# Altium schematic sheet FPGA_ADC_N.SchDoc
size 393 x 281 mm; PageSetup: Record=PageOptions|CenterHorizontal=True|CenterVertical=True|PrintScale=0.94|XCorrection=0.00|YCorrection=0.00|PrintKind=0|BorderSize=5000000|LeftOffset=0|BottomOffset=0|Orientation=2|PaperLength=1000|PaperWidth=1000|Scale=100|PaperSource=15|PrintQuality=600|MediaType=1|DitherType=10|PrintScaleMode=1|PaperKind=A4; Adr1: August Barks gata 6B; Adr2: SE-421 32 Västra Frölunda; Adr3: Sweden; Webpage: www.omnisys.se
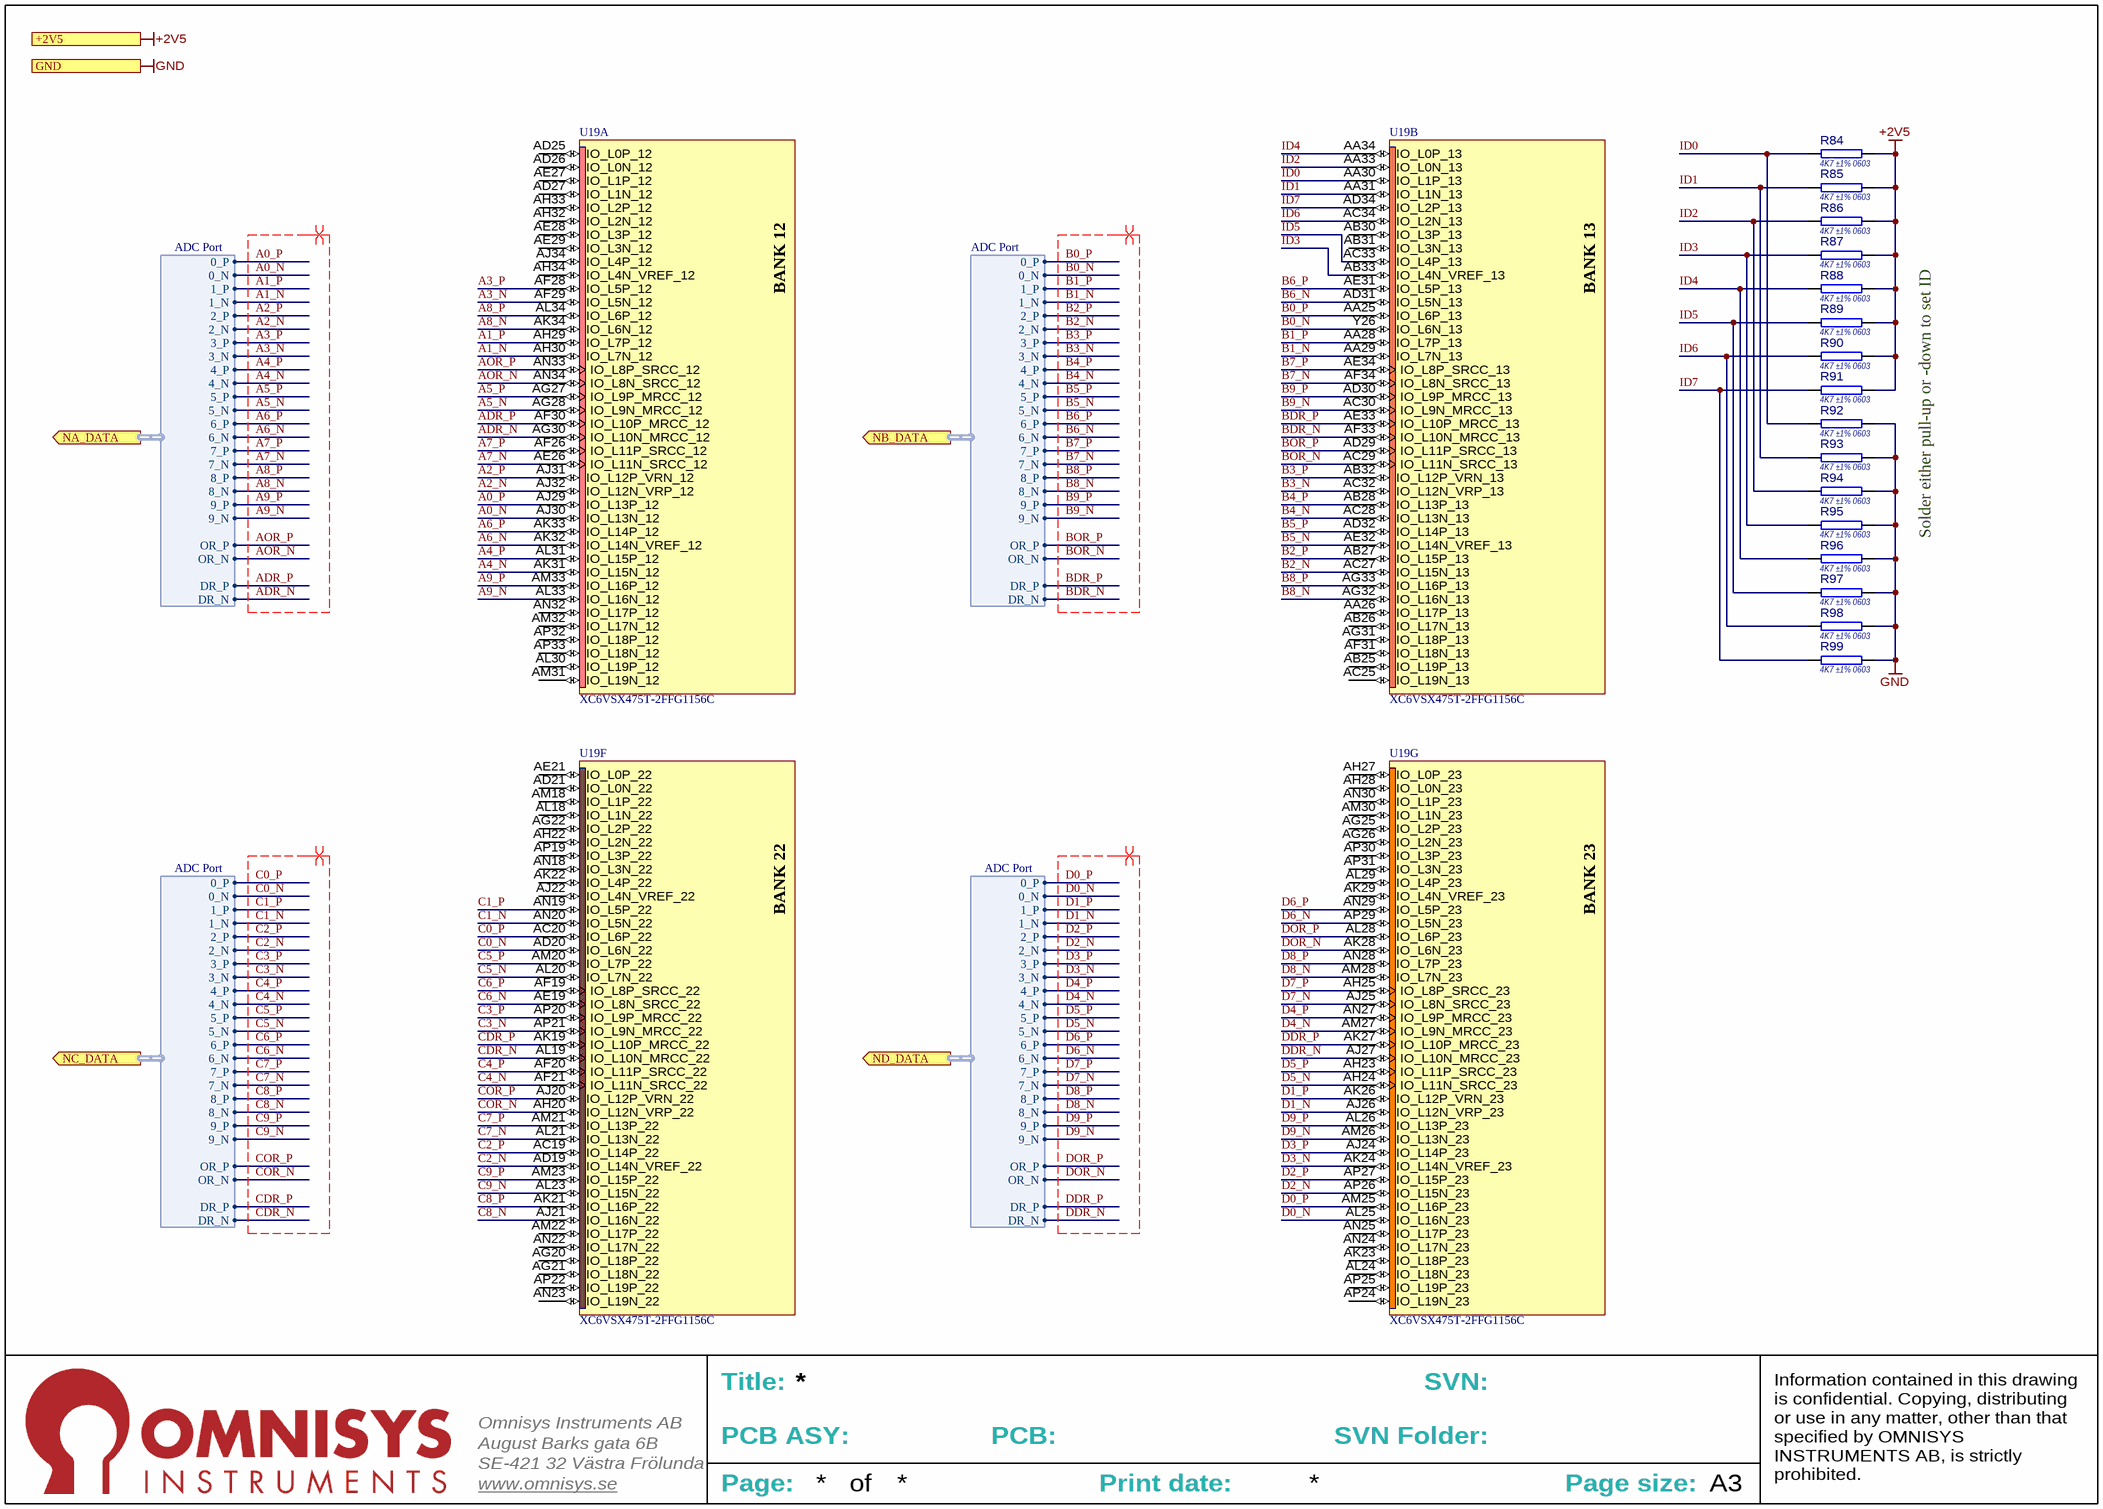
[diagram p0: FPGA_ADC_N.SchDoc]

## Parts
R84  4K7 ±1% 0603  [RESC1608N]
R85  4K7 ±1% 0603  [RESC1608N]
R86  4K7 ±1% 0603  [RESC1608N]
R87  4K7 ±1% 0603  [RESC1608N]
R88  4K7 ±1% 0603  [RESC1608N]
R89  4K7 ±1% 0603  [RESC1608N]
R90  4K7 ±1% 0603  [RESC1608N]
R91  4K7 ±1% 0603  [RESC1608N]
R92  4K7 ±1% 0603  [RESC1608N]
R93  4K7 ±1% 0603  [RESC1608N]
R94  4K7 ±1% 0603  [RESC1608N]
R95  4K7 ±1% 0603  [RESC1608N]
R96  4K7 ±1% 0603  [RESC1608N]
R97  4K7 ±1% 0603  [RESC1608N]
R98  4K7 ±1% 0603  [RESC1608N]
R99  4K7 ±1% 0603  [RESC1608N]
U19  XC6VSX475T-2FFG1156C  [FFG1156]  (parts A,B,F,G of 20)

## Ports
+2V5, GND, NA_DATA (out, harness ADC Port), NB_DATA (out, harness ADC Port), NC_DATA (out, harness ADC Port), ND_DATA (out, harness ADC Port)

## Harnesses
ADC Port: 0_P, 1_P, 2_P, 3_P, 4_P, 5_P, 6_P, 7_P, 8_P, 9_P, 0_N, 1_N, 2_N, 3_N, 4_N, 5_N, 6_N, 7_N, 8_N, 9_N, OR_P, OR_N, DR_P, DR_N

## Nets
+2V5: R84.1 R85.1 R86.1 R87.1 R88.1 R89.1 R90.1 R91.1 ; port +2V5
GND: R92.1 R93.1 R94.1 R95.1 R96.1 R97.1 R98.1 R99.1 ; port GND
A0_N: U19.AJ30(IO_L13N_12) ; port NA_DATA.0_N
A0_P: U19.AJ29(IO_L13P_12) ; port NA_DATA.0_P
A1_N: U19.AH30(IO_L7N_12) ; port NA_DATA.1_N
A1_P: U19.AH29(IO_L7P_12) ; port NA_DATA.1_P
A2_N: U19.AJ32(IO_L12N_VRP_12) ; port NA_DATA.2_N
A2_P: U19.AJ31(IO_L12P_VRN_12) ; port NA_DATA.2_P
A3_N: U19.AF29(IO_L5N_12) ; port NA_DATA.3_N
A3_P: U19.AF28(IO_L5P_12) ; port NA_DATA.3_P
A4_N: U19.AK31(IO_L15N_12) ; port NA_DATA.4_N
A4_P: U19.AL31(IO_L15P_12) ; port NA_DATA.4_P
A5_N: U19.AG28(IO_L9N_MRCC_12) ; port NA_DATA.5_N
A5_P: U19.AG27(IO_L9P_MRCC_12) ; port NA_DATA.5_P
A6_N: U19.AK32(IO_L14N_VREF_12) ; port NA_DATA.6_N
A6_P: U19.AK33(IO_L14P_12) ; port NA_DATA.6_P
A7_N: U19.AE26(IO_L11N_SRCC_12) ; port NA_DATA.7_N
A7_P: U19.AF26(IO_L11P_SRCC_12) ; port NA_DATA.7_P
A8_N: U19.AK34(IO_L6N_12) ; port NA_DATA.8_N
A8_P: U19.AL34(IO_L6P_12) ; port NA_DATA.8_P
A9_N: U19.AL33(IO_L16N_12) ; port NA_DATA.9_N
A9_P: U19.AM33(IO_L16P_12) ; port NA_DATA.9_P
ADR_N: U19.AG30(IO_L10N_MRCC_12) ; port NA_DATA.DR_N
ADR_P: U19.AF30(IO_L10P_MRCC_12) ; port NA_DATA.DR_P
AOR_N: U19.AN34(IO_L8N_SRCC_12) ; port NA_DATA.OR_N
AOR_P: U19.AN33(IO_L8P_SRCC_12) ; port NA_DATA.OR_P
B0_N: U19.Y26(IO_L6N_13) ; port NB_DATA.0_N
B0_P: U19.AA25(IO_L6P_13) ; port NB_DATA.0_P
B1_N: U19.AA29(IO_L7N_13) ; port NB_DATA.1_N
B1_P: U19.AA28(IO_L7P_13) ; port NB_DATA.1_P
B2_N: U19.AC27(IO_L15N_13) ; port NB_DATA.2_N
B2_P: U19.AB27(IO_L15P_13) ; port NB_DATA.2_P
B3_N: U19.AC32(IO_L12N_VRP_13) ; port NB_DATA.3_N
B3_P: U19.AB32(IO_L12P_VRN_13) ; port NB_DATA.3_P
B4_N: U19.AC28(IO_L13N_13) ; port NB_DATA.4_N
B4_P: U19.AB28(IO_L13P_13) ; port NB_DATA.4_P
B5_N: U19.AE32(IO_L14N_VREF_13) ; port NB_DATA.5_N
B5_P: U19.AD32(IO_L14P_13) ; port NB_DATA.5_P
B6_N: U19.AD31(IO_L5N_13) ; port NB_DATA.6_N
B6_P: U19.AE31(IO_L5P_13) ; port NB_DATA.6_P
B7_N: U19.AF34(IO_L8N_SRCC_13) ; port NB_DATA.7_N
B7_P: U19.AE34(IO_L8P_SRCC_13) ; port NB_DATA.7_P
B8_N: U19.AG32(IO_L16N_13) ; port NB_DATA.8_N
B8_P: U19.AG33(IO_L16P_13) ; port NB_DATA.8_P
B9_N: U19.AC30(IO_L9N_MRCC_13) ; port NB_DATA.9_N
B9_P: U19.AD30(IO_L9P_MRCC_13) ; port NB_DATA.9_P
BDR_N: U19.AF33(IO_L10N_MRCC_13) ; port NB_DATA.DR_N
BDR_P: U19.AE33(IO_L10P_MRCC_13) ; port NB_DATA.DR_P
BOR_N: U19.AC29(IO_L11N_SRCC_13) ; port NB_DATA.OR_N
BOR_P: U19.AD29(IO_L11P_SRCC_13) ; port NB_DATA.OR_P
C0_N: U19.AD20(IO_L6N_22) ; port NC_DATA.0_N
C0_P: U19.AC20(IO_L6P_22) ; port NC_DATA.0_P
C1_N: U19.AN20(IO_L5N_22) ; port NC_DATA.1_N
C1_P: U19.AN19(IO_L5P_22) ; port NC_DATA.1_P
C2_N: U19.AD19(IO_L14N_VREF_22) ; port NC_DATA.2_N
C2_P: U19.AC19(IO_L14P_22) ; port NC_DATA.2_P
C3_N: U19.AP21(IO_L9N_MRCC_22) ; port NC_DATA.3_N
C3_P: U19.AP20(IO_L9P_MRCC_22) ; port NC_DATA.3_P
C4_N: U19.AF21(IO_L11N_SRCC_22) ; port NC_DATA.4_N
C4_P: U19.AF20(IO_L11P_SRCC_22) ; port NC_DATA.4_P
C5_N: U19.AL20(IO_L7N_22) ; port NC_DATA.5_N
C5_P: U19.AM20(IO_L7P_22) ; port NC_DATA.5_P
C6_N: U19.AE19(IO_L8N_SRCC_22) ; port NC_DATA.6_N
C6_P: U19.AF19(IO_L8P_SRCC_22) ; port NC_DATA.6_P
C7_N: U19.AL21(IO_L13N_22) ; port NC_DATA.7_N
C7_P: U19.AM21(IO_L13P_22) ; port NC_DATA.7_P
C8_N: U19.AJ21(IO_L16N_22) ; port NC_DATA.8_N
C8_P: U19.AK21(IO_L16P_22) ; port NC_DATA.8_P
C9_N: U19.AL23(IO_L15N_22) ; port NC_DATA.9_N
C9_P: U19.AM23(IO_L15P_22) ; port NC_DATA.9_P
CDR_N: U19.AL19(IO_L10N_MRCC_22) ; port NC_DATA.DR_N
CDR_P: U19.AK19(IO_L10P_MRCC_22) ; port NC_DATA.DR_P
COR_N: U19.AH20(IO_L12N_VRP_22) ; port NC_DATA.OR_N
COR_P: U19.AJ20(IO_L12P_VRN_22) ; port NC_DATA.OR_P
D0_N: U19.AL25(IO_L16N_23) ; port ND_DATA.0_N
D0_P: U19.AM25(IO_L16P_23) ; port ND_DATA.0_P
D1_N: U19.AJ26(IO_L12N_VRP_23) ; port ND_DATA.1_N
D1_P: U19.AK26(IO_L12P_VRN_23) ; port ND_DATA.1_P
D2_N: U19.AP26(IO_L15N_23) ; port ND_DATA.2_N
D2_P: U19.AP27(IO_L15P_23) ; port ND_DATA.2_P
D3_N: U19.AK24(IO_L14N_VREF_23) ; port ND_DATA.3_N
D3_P: U19.AJ24(IO_L14P_23) ; port ND_DATA.3_P
D4_N: U19.AM27(IO_L9N_MRCC_23) ; port ND_DATA.4_N
D4_P: U19.AN27(IO_L9P_MRCC_23) ; port ND_DATA.4_P
D5_N: U19.AH24(IO_L11N_SRCC_23) ; port ND_DATA.5_N
D5_P: U19.AH23(IO_L11P_SRCC_23) ; port ND_DATA.5_P
D6_N: U19.AP29(IO_L5N_23) ; port ND_DATA.6_N
D6_P: U19.AN29(IO_L5P_23) ; port ND_DATA.6_P
D7_N: U19.AJ25(IO_L8N_SRCC_23) ; port ND_DATA.7_N
D7_P: U19.AH25(IO_L8P_SRCC_23) ; port ND_DATA.7_P
D8_N: U19.AM28(IO_L7N_23) ; port ND_DATA.8_N
D8_P: U19.AN28(IO_L7P_23) ; port ND_DATA.8_P
D9_N: U19.AM26(IO_L13N_23) ; port ND_DATA.9_N
D9_P: U19.AL26(IO_L13P_23) ; port ND_DATA.9_P
DDR_N: U19.AJ27(IO_L10N_MRCC_23) ; port ND_DATA.DR_N
DDR_P: U19.AK27(IO_L10P_MRCC_23) ; port ND_DATA.DR_P
DOR_N: U19.AK28(IO_L6N_23) ; port ND_DATA.OR_N
DOR_P: U19.AL28(IO_L6P_23) ; port ND_DATA.OR_P
ID0: R84.2 R92.2 U19.AA30(IO_L1P_13)
ID1: R85.2 R93.2 U19.AA31(IO_L1N_13)
ID2: R86.2 R94.2 U19.AA33(IO_L0N_13)
ID3: R87.2 R95.2 U19.AB33(IO_L4N_VREF_13)
ID4: R88.2 R96.2 U19.AA34(IO_L0P_13)
ID5: R89.2 R97.2 U19.AC33(IO_L4P_13)
ID6: R90.2 R98.2 U19.AC34(IO_L2N_13)
ID7: R91.2 R99.2 U19.AD34(IO_L2P_13)

Not connected (* = marked no-connect by the designer): U19 AA26(IO_L17P_13) AB25(IO_L19P_13) AB26(IO_L17N_13) AB30(IO_L3P_13) AB31(IO_L3N_13) AC25(IO_L19N_13) AD21(IO_L0N_22) AD25(IO_L0P_12) AD26(IO_L0N_12) AD27(IO_L1N_12) AE21(IO_L0P_22) AE27(IO_L1P_12) AE28(IO_L3P_12) AE29(IO_L3N_12) AF31(IO_L18N_13) AG20(IO_L18P_22) AG21(IO_L18N_22) AG22(IO_L2P_22) AG25(IO_L2P_23) AG26(IO_L2N_23) AG31(IO_L18P_13) AH22(IO_L2N_22) AH27(IO_L0P_23) AH28(IO_L0N_23) AH32(IO_L2N_12) AH33(IO_L2P_12) AH34(IO_L4N_VREF_12) AJ22(IO_L4N_VREF_22) AJ34(IO_L4P_12) AK22(IO_L4P_22) AK23(IO_L18P_23) AK29(IO_L4N_VREF_23) AL18(IO_L1N_22) AL24(IO_L18N_23) AL29(IO_L4P_23) AL30(IO_L19P_12) AM18(IO_L1P_22) AM22(IO_L17P_22) AM30(IO_L1N_23) AM31(IO_L19N_12) AM32(IO_L17N_12) AN18(IO_L3N_22) AN22(IO_L17N_22) AN23(IO_L19N_22) AN24(IO_L17N_23) AN25(IO_L17P_23) AN30(IO_L1P_23) AN32(IO_L17P_12) AP19(IO_L3P_22) AP22(IO_L19P_22) AP24(IO_L19N_23) AP25(IO_L19P_23) AP30(IO_L3P_23) AP31(IO_L3N_23) AP32(IO_L18P_12) AP33(IO_L18N_12)

## Layout directives
differential pair; rule Differential Pairs Routing [Pref Gap = 0.1mm    Min Gap  = 0.1mm    Max Gap  = 0.1mmPref Width = 0.1mm    Min Width  = 0.1mm    Max Width  = 0.1mm]; net class DiffPairs_FPGA: A0_N, A0_P, A1_N, A1_P, A2_N, A2_P, A3_N, A3_P, A4_N, A4_P, A5_N, A5_P, A6_N, A6_P, A7_N, A7_P, A8_N, A8_P, A9_N, A9_P, ADR_N, ADR_P, AOR_N, AOR_P, B0_N, B0_P, B1_N, B1_P, B2_N, B2_P, B3_N, B3_P, B4_N, B4_P, B5_N, B5_P, B6_N, B6_P, B7_N, B7_P, B8_N, B8_P, B9_N, B9_P, BDR_N, BDR_P, BOR_N, BOR_P, C0_N, C0_P, C1_N, C1_P, C2_N, C2_P, C3_N, C3_P, C4_N, C4_P, C5_N, C5_P, C6_N, C6_P, C7_N, C7_P, C8_N, C8_P, C9_N, C9_P, CDR_N, CDR_P, COR_N, COR_P, D0_N, D0_P, D1_N, D1_P, D2_N, D2_P, D3_N, D3_P, D4_N, D4_P, D5_N, D5_P, D6_N, D6_P, D7_N, D7_P, D8_N, D8_P, D9_N, D9_P, DDR_N, DDR_P, DOR_N, DOR_P

## Notes on the sheet
- Solder either pull-up or -down to set ID
- Title:
- SVN:
- August Barks gata 6B
- SE-421 32 Västra Frölunda
- Omnisys Instruments AB
- PCB ASY:
- PCB:
- SVN Folder:
- www.omnisys.se
- Page:
- of
- Print date:
- Page size:
- A3
- Information contained in this drawing is confidential. Copying, distributing or use in any matter, other than that specified by OMNISYS INSTRUMENTS AB, is strictly prohibited.
- (in symbol CMP-0083-00172-1, part A) BANK 12
- (in symbol CMP-0083-00172-1, part B) BANK 13
- (in symbol CMP-0083-00172-1, part F) BANK 22
- (in symbol CMP-0083-00172-1, part G) BANK 23

## Library data of the parts
R84-R99 = CMP-1800-002037-3: 4K7 ±1% ±100 ppm/˚C 0.10W 75V 0603 (1608 metric); Value: 4.7k; Power: 100mW; Case-EIA: 0603; Case-Metric: 1608; Temp. Coefficent: 0.01%; Maximum working voltage: 75V; Tolerance: 1%; Technology: SMT
U19 = CMP-0083-00172-1: Virtex-6 SXT Platform FPGA, 600 User I/Os, 20 GTXs, 1156-Ball FFBGA, Speed Grade 2, Commercial Grade, Pb-Free; Code_JEDEC: MS-034-AAR-1; PackageReference: FFG1156; Code_IPC: BGA100P34X34-1156; PackageDescription: 1156-Ball Flip-Chip Fine Pitch Ball Grid Array (FFG1156) - Pb-Free; PackageVersion: ver1.0, Jan-2010; DatasheetVersion: ver2.2, Jan-2010; PartId: 1